# Altium schematic sheet esp32.SchDoc
size A4; SheetNumber: 7; SheetTotal: 10
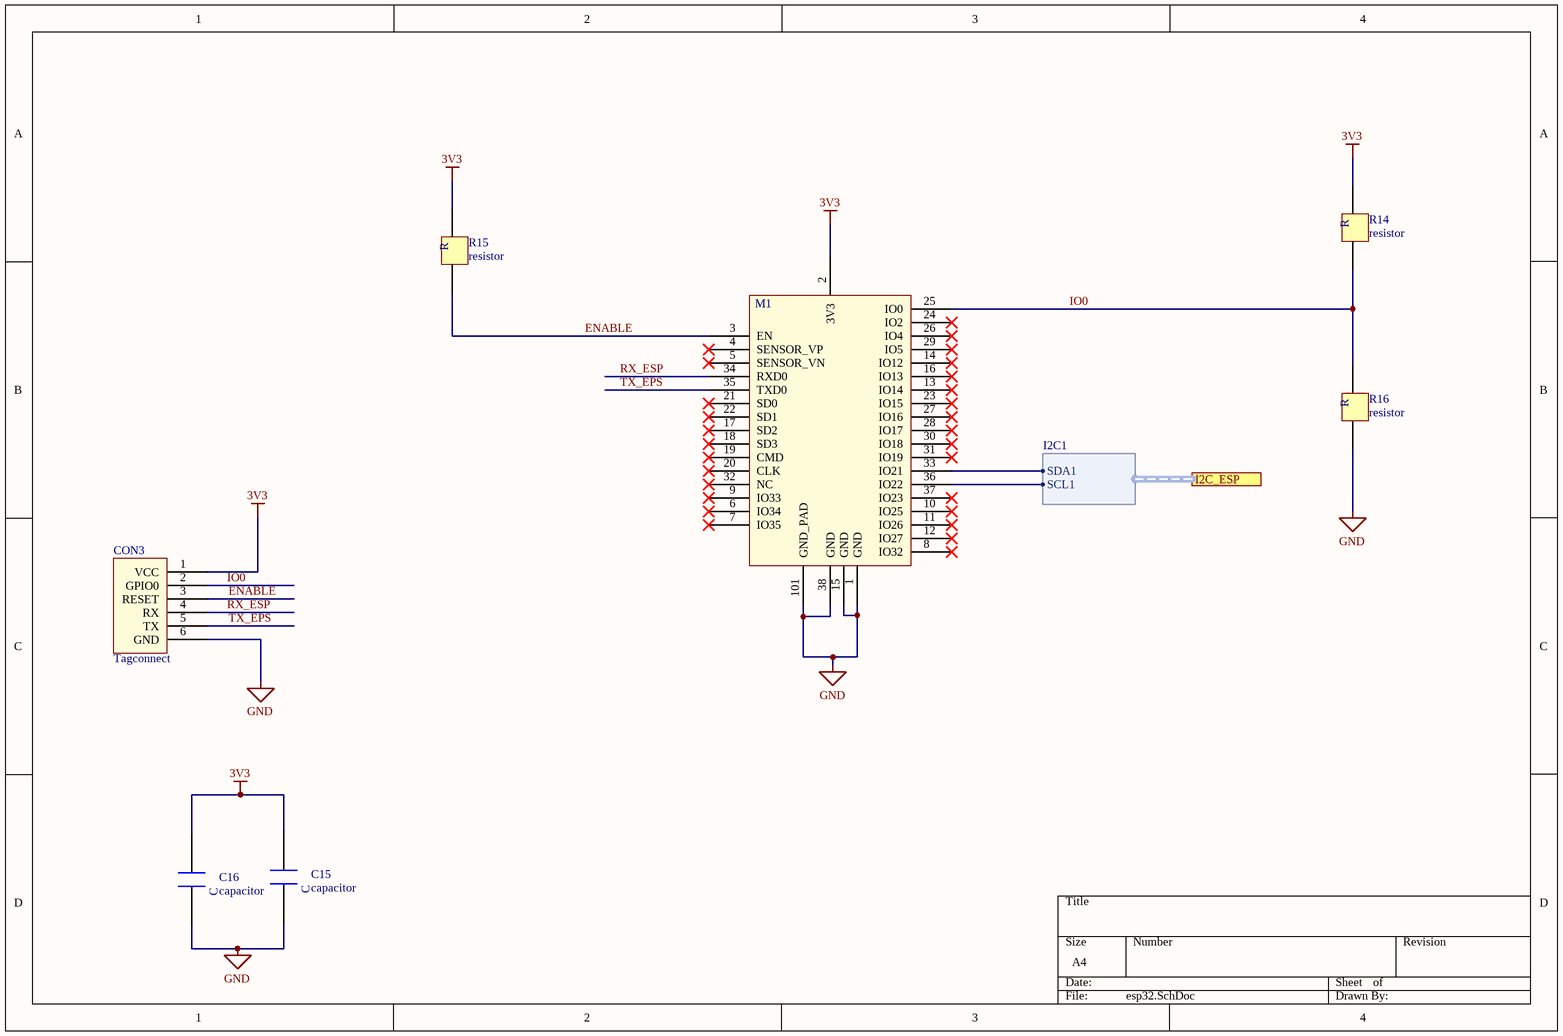
[diagram p0: esp32.SchDoc]

## Parts
C15  capacitor  [CAPC1005X04L]
C16  capacitor  [CAPC1005X04L]
CON3  Tagconnect  [Tagconnect]
M1  ESP32S_Module  [ESP32S]  (value not drawn)
R14  resistor  [CAPC1005X04L]
R15  resistor  [CAPC1005X04L]
R16  resistor  [CAPC1005X04L]

## Ports
I2C_ESP (harness I2C1)

## Harnesses
I2C1: SDA1, SCL1

## Nets
3V3: C15.1 C16.1 CON3.1(VCC) M1.2(3V3) R14.1 R15.1
GND: C15.2 C16.2 CON3.6(GND) M1.1(GND) M1.15(GND) M1.38(GND) M1.101(GND_PAD) R16.2
ENABLE: CON3.3(RESET) M1.3(EN) R15.2
IO0: CON3.2(GPIO0) M1.25(IO0) R14.2 R16.1
RX_ESP: CON3.4(RX) M1.34(RXD0)
TX_EPS: CON3.5(TX) M1.35(TXD0)
NetM1_33: M1.33(IO21) ; port I2C_ESP.SDA1
NetM1_36: M1.36(IO22) ; port I2C_ESP.SCL1

Not connected (* = marked no-connect by the designer): M1 4(SENSOR_VP)* 5(SENSOR_VN)* 6(IO34)* 7(IO35)* 8(IO32)* 9(IO33)* 10(IO25)* 11(IO26)* 12(IO27)* 13(IO14)* 14(IO12)* 16(IO13)* 17(SD2)* 18(SD3)* 19(CMD)* 20(CLK)* 21(SD0)* 22(SD1)* 23(IO15)* 24(IO2)* 26(IO4)* 27(IO16)* 28(IO17)* 29(IO5)* 30(IO18)* 31(IO19)* 32(NC)* 37(IO23)*

## Notes on the sheet
- (in symbol capacitor) C
- (in symbol resistor) R

## Library data of the parts
M1 = ESP32S_Module: Esp-32S; Datasheet: https://espressif.com/sites/default/files/documentation/esp_wroom_32_datasheet_en.pdf